# EAGLE design rtmi (EAGLE 9.3.2)
COMPANY: IPL; CREVISION: V1.0; DESIGNER: Rafael Silva; LICENSE: GNU General Public License v3.0; LINK: https://github.com/gimbas/fmc
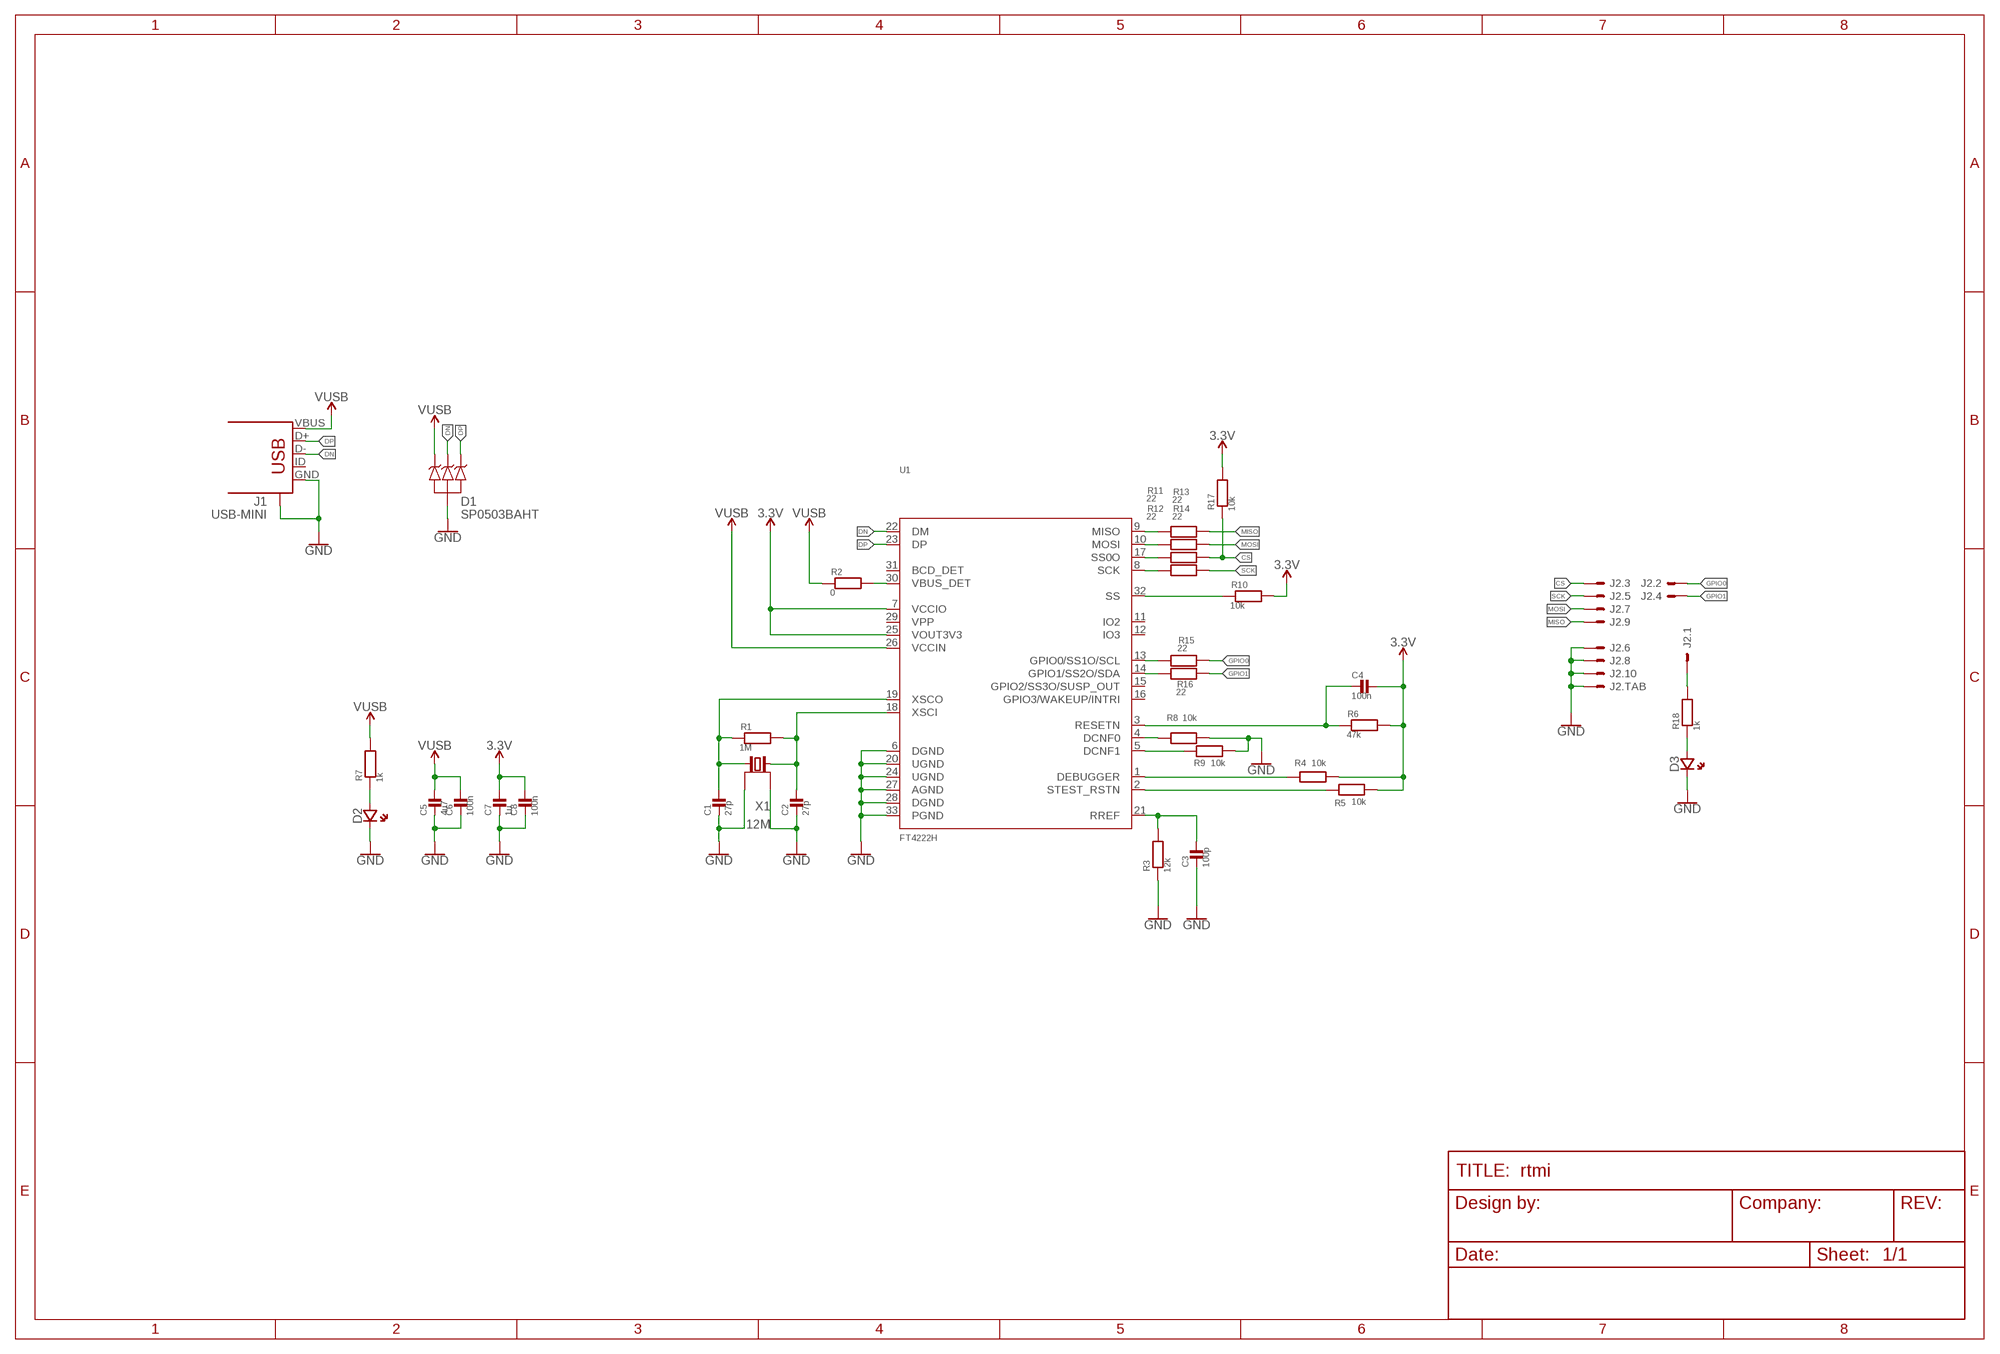
[diagram p0: schematic, sheet 1]

## Parts
C1  27p  MLCC0603  [0603_WAVE]
C2  27p  MLCC0603  [0603_WAVE]
C3  100p  MLCC0603  [0603_WAVE]
C4  100n  MLCC0603  [0603_WAVE]
C5  4u7  MLCC0603  [0603_WAVE]
C6  100n  MLCC0603  [0603_WAVE]
C7  1u  MLCC0603  [0603_WAVE]
C8  100n  MLCC0603  [0603_WAVE]
D1  SP0503BAHT  [SOT143]
D2  LED0603  [CHIPLED_0603]
D3  LED0603  [CHIPLED_0603]
J1  USB-MINI  [USB-MINI-SMD]
J2  F20F-10DP-1V  [F20F-10DP-1V]
R1  1M  RESISTOR0603  [0603_WAVE]
R2  0  RESISTOR0603  [0603_WAVE]
R3  12k  RESISTOR0603  [0603_WAVE]
R4  10k  RESISTOR0603  [0603_WAVE]
R5  10k  RESISTOR0603  [0603_WAVE]
R6  47k  RESISTOR0603  [0603_WAVE]
R7  1k  RESISTOR0603  [0603_WAVE]
R8  10k  RESISTOR0603  [0603_WAVE]
R9  10k  RESISTOR0603  [0603_WAVE]
R10  10k  RESISTOR0603  [0603_WAVE]
R11  22  RESISTOR0603  [0603_WAVE]
R12  22  RESISTOR0603  [0603_WAVE]
R13  22  RESISTOR0603  [0603_WAVE]
R14  22  RESISTOR0603  [0603_WAVE]
R15  22  RESISTOR0603  [0603_WAVE]
R16  22  RESISTOR0603  [0603_WAVE]
R17  10k  RESISTOR0603  [0603_WAVE]
R18  1k  RESISTOR0603  [0603_WAVE]
U1  FT4222H  [QFN32]
X1  12M  CRYSTAL_4P  [4-SMD-3225]

## Nets
3.3V: C4.P$1 C7.P$1 C8.P$1 R4.P$2 R5.P$2 R6.P$2 R10.P$2 R17.P$2 U1.7(VCCIO) U1.25(VOUT3V3)
3V3EXT: J2.1 R18.P$2
3V3EXT_LED: D3.A(AN) R18.P$1
CS: J2.3 R13.P$2 R17.P$1
DCFN1: R9.P$1 U1.5(DCNF1)
DCNF0: R8.P$1 U1.4(DCNF0)
DEBUGGER: R4.P$1 U1.1(DEBUGGER)
DN: D1.3 J1.D- U1.22(DM)
DP: D1.4 J1.D+ U1.23(DP)
GND: C1.P$2 C2.P$2 C3.P$2 C5.P$2 C6.P$2 C7.P$2 C8.P$2 D1.1 D2.C(CA) D3.C(CA) J1.GND J1.GND@1(CASE) J1.GND@2(CASE) J1.GND@3(CASE) J1.GND@4(CASE) J2.6 J2.8 J2.10 J2.TAB1 J2.TAB2 R3.P$1 R8.P$2 R9.P$2 U1.6(DGND) U1.20(UGND) U1.24(UGND) U1.27(AGND) U1.28(DGND) U1.33(PGND) X1.2(GND) X1.4(GND)
GPIO0: J2.2 R15.P$2
GPIO0_PIN: R15.P$1 U1.13(GPIO0/SS1O/SCL)
GPIO1: J2.4 R16.P$2
GPIO1_PIN: R16.P$1 U1.14(GPIO1/SS2O/SDA)
MISO: J2.9 R11.P$2
MISO_PIN: R11.P$1 U1.9(MISO)
MOSI: J2.7 R12.P$2
MOSI_PIN: R12.P$1 U1.10(MOSI)
RESETN: C4.P$2 R6.P$1 U1.3(RESETN)
RREF: C3.P$1 R3.P$2 U1.21(RREF)
SCK: J2.5 R14.P$2
SCK_PIN: R14.P$1 U1.8(SCK)
SS0O_PIN: R13.P$1 U1.17(SS0O)
SS_PIN: R10.P$1 U1.32(SS)
STEST_RSTN: R5.P$1 U1.2(STEST_RSTN)
VBUS_DET: R2.P$2 U1.30(VBUS_DET)
VUSB: C5.P$1 C6.P$1 D1.2 J1.VBUS R2.P$1 R7.P$2 U1.26(VCCIN)
VUSB_LED: D2.A(AN) R7.P$1
XSCI: C2.P$1 R1.P$2 U1.18(XSCI) X1.1
XSCO: C1.P$1 R1.P$1 U1.19(XSCO) X1.3
Unconnected: J1.ID U1.11(IO2) U1.12(IO3) U1.15(GPIO2/SS3O/SUSP_OUT) U1.16(GPIO3/WAKEUP/INTRI) U1.29(VPP) U1.31(BCD_DET)

## Library data of the parts
C1-C8 = Passive Components > Capacitors > Multilayer Ceramic Capacitors MLCC:MLCC: KEMET’s X7R dielectric features a 125°C maximum operating temperature and is considered temperature stable. The Electronics Components, Assemblies and Materials Association (EIA) characterizes X7R dielectric as a Class II material. Components of this classification are fixed, ceramic dielectric capacitors suited for bypass and decoupling applications or for frequency discriminating circuits where Q and stability of capacitance characteristics are not critical. X7R exhibits a predictable change in capacitance with respect to time and voltage, boasting a minimal change in capacitance with reference to ambient temperature. Capacitance change is limited to ±15% from −55°C to +125°C.
D1 = Circuit Protection > ESD Suppressors \ TVS Diodes:SP0503BAHT
D2 D3 = Opto-electronics > LED Emitters:LED: LED 0603 - 0603 Surface Mount Package 2mA: Green LED - Low Power (3.9mcd, 2ma, 1.7Vf) - Digikey: 475-2709-2-ND Orange LED - Low Power (9.8mcd, 2ma, 1.8Vf) - Digikey: 475-1194-2-ND Red LED - Low Power (5mcd, 2ma, 1.8Vf) - Digikey: 475-1195-2-ND Yellow LED - Low Power (7mcd, 2ma, 1.8Vf) - Digikey: 475-1196-2-ND 5mA: Blue LED - Low Power (17mcd, 5ma, 2.9Vf) - Digikey: LNJ937W8CRACT-ND 0805 - 0805 Surface Mount Package 2mA: Red LED (8.8mcd, 2mA, 1.8Vf, Clear) - Low Power [Digikey: 475-2510-1-ND] Green LED (5mcd, 2mA, 1.8Vf, Clear) - Low Power [Digikey: 475-2730-1-ND] Yellow LED (11.3mcd, 2mA, 1.8Vf, Clear) - Low Power [Digikey: 475-2555-1-ND] 20mA: Red LED (104mcd, 20mA, Diffused) - LS R976 [Digikey: 475-1278-6-ND] Red LED (12mcd, 20mA, 2.0Vf, Clear) - APT2012EC [Digikey: 754-1128-1-ND] Green LED (15mcd, 20mA, 2.2Vf, Clear) - APT2012GC [Digikey: 754-1131-1-ND] Orange LED (160mcd, 20mA, 2.1Vf, Clear) - APT2012SECK [Digikey: 754-1130-1-ND] 1206 - 1206 Surface Mount Package Green LED (26mcd, 20mA, Diffused) - LG N971 [Digikey: 475-1407-6-ND] Red LED (15mcd, 20mA, Diffused) - LH N974 [Digikey: 475-1416-6-ND] Cree - Cree High-Power Surface Mount LEDs XPEBWT-L1-0000-00D50 - White 111lm 350mA 2.9Vf 6200K 110° XTEAWT-00-0000-00000LEE3 - White 114lm 350mA 2.85Vf 5000K 115° Everlight - Everlight 45-21 Series Surface Mount LEDs 45-21/QK2C-B2832AC2CB2/2T - Warm White 2000mcd 20mA 3.25Vf 3050K 120° 45-21/LK2C-B38452C4CB2/2T - Nuetral White 2000mcd 20mA 3.25Vf 4150K 120° 45-21/LK2C-B50634C6CB2/2T - Cold White 2200mcd 20mA 3.25Vf 5650K 120° PLCC2 Reverse Mount LS T77K-J1L2-1-0-2-R18-Z - Red 11.25mcd 2mA 1.8Vf 630nm 120° LO T77K-L1M2-24-Z - Orange 19.6mcd 2mA 1.8Vf 606nm 120° LY T77K-K2M1-26-Z - Yellow 15.7mcd 2mA 1.8Vf 587nm 120°
J1 = Connectors > USB:USB-MINI
J2 = Connectors > Other:F20F-10DP-1V
R1-R18 = Passive Components > Resistors > Chip Resistors:RESISTOR: Resistors For new designs, use the packages preceded by an '_' character since they are more reliable: The following footprints should be used on most boards: _0402 - Standard footprint for regular board layouts _0603 - Standard footprint for regular board layouts _0805 - Standard footprint for regular board layouts _1206 - Standard footprint for regular board layouts For extremely tight-pitch boards where space is at a premium, the following 'micro-pitch' footprints can be used (smaller pads, no silkscreen outline, etc.): _0402MP - Micro-pitch footprint for very dense/compact boards _0603MP - Micro-pitch footprint for very dense/compact boards _0805MP - Micro-pitch footprint for very dense/compact boards _1206MP - Micro-pitch footprint for very dense/compact boards
U1 = Semiconductors > Integrated Circuits - ICs > Interface ICs > USB Interface IC:FT4222H
X1 = Passive Components > Frequency Control & Timing Devices > Crystals:CRYSTAL_4P

## Board
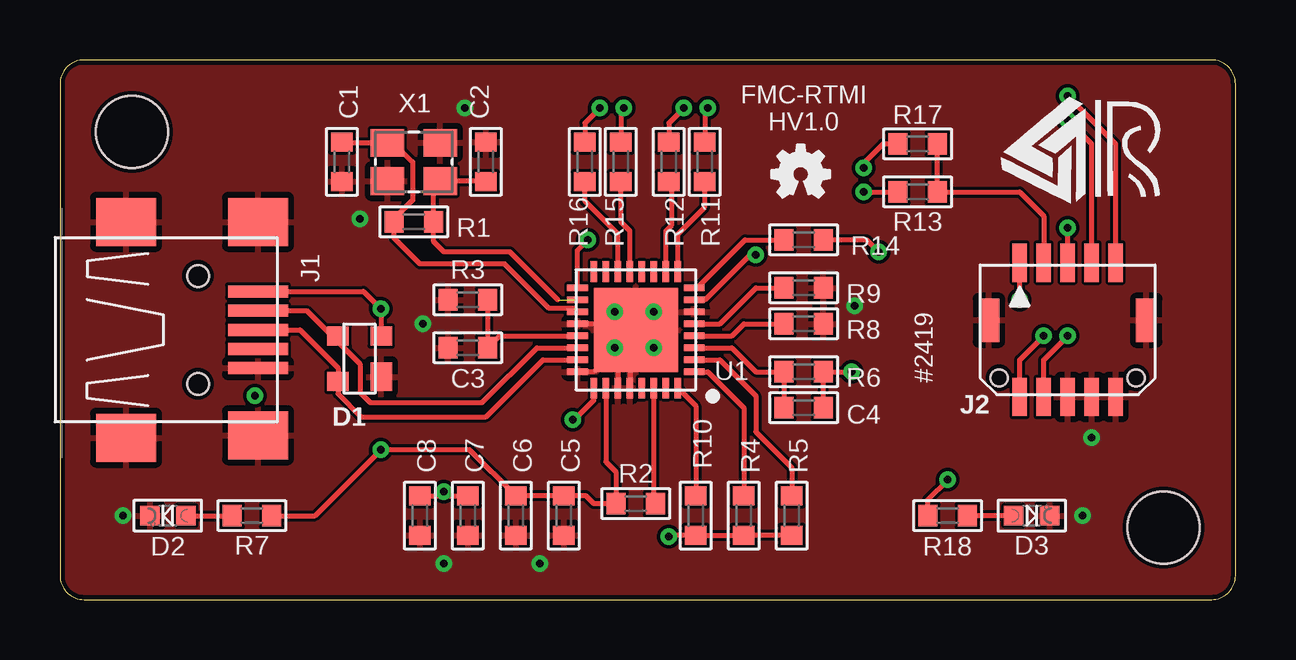
[diagram p1: board, top side]
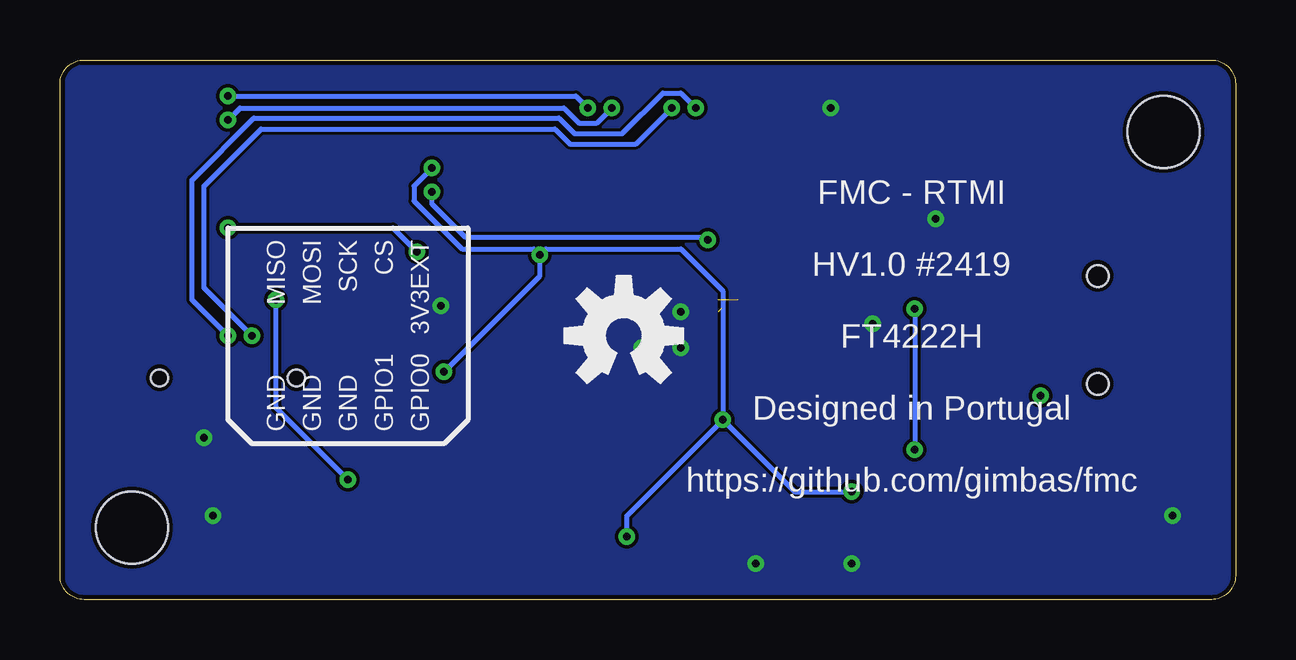
[diagram p2: board, bottom side, seen from below]

Size 49 x 22.5 mm. Coordinates in mm from the lower left corner, seen from the top.
Outline: 1,0 48,0 arc90 49,1 49,21.5 arc90 48,22.5 1,22.5 arc90 0,21.5 0,1 arc90 1,0
Copper layers (1*16): Top 0.035mm / dielectric 1.6mm / Bottom 0.035mm
Design rules "jlcpcb-dr": minimum track width 5mil, minimum drill 0.3mm, track to track 5mil, track to pad 5mil, pad to pad 5mil, via to via 5mil, smd to smd 5mil, copper to edge 0.2mm, drill to drill 5mil, minimum pad ring 10mil, minimum via ring 8mil, stop-mask expansion 4mil, vias tented up to drill 0.7mm, thermal gap 10mil
Holes 3 mm at 3,19.5 46,3

### Footprints (pad centres in the part's own frame; a part is rotated, then mirrored left to right if it is on the bottom)
0603_WAVE = smd 0.8 x 0.9: P$1 -0.823,0; P$2 0.823,0
SOT143 = smd 1.2 x 0.9: 1 -0.711,-0.889 | smd 0.8 x 0.9: 2 0.989,-0.889; 3 0.989,0.911; 4 -0.911,0.911
CHIPLED_0603 = smd 0.8 x 0.8: A 0,-0.75; C 0,0.75
USB-MINI-SMD = smd 2.5 x 0.5: D+ 2.75,0; D- 2.75,0.8; GND 2.75,-1.6; ID 2.75,-0.8; VBUS 2.75,1.6 | smd 2.5 x 2: GND@1 -2.75,-4.5; GND@2 -2.75,4.5; GND@3 2.75,-4.4; GND@4 2.75,4.5 | hole 0.9: 0.25,2.25; 0.25,-2.25
F20F-10DP-1V = smd 0.6 x 1.6: 1 -2,2.8; 2 -2,-2.8; 3 -1,2.8; 4 -1,-2.8; 5 0,2.8; 6 0,-2.8; 7 1,2.8; 8 1,-2.8; 9 2,2.8; 10 2,-2.8 | smd 0.85 x 1.8: TAB1 -3.275,0.4; TAB2 3.275,0.4 | hole 0.7: -2.85,-2.005; 2.85,-2.005
QFN32 = smd 0.86 x 0.26: 1 -2.43,1.75; 2 -2.43,1.25; 3 -2.43,0.75; 4 -2.43,0.25; 5 -2.43,-0.25; 6 -2.43,-0.75; 7 -2.43,-1.25; 8 -2.43,-1.75; 17 2.43,-1.75; 18 2.43,-1.25; 19 2.43,-0.75; 20 2.43,-0.25; 21 2.43,0.25; 22 2.43,0.75; 23 2.43,1.25; 24 2.43,1.75 | smd 0.26 x 0.86: 9 -1.75,-2.43; 10 -1.25,-2.43; 11 -0.75,-2.43; 12 -0.25,-2.43; 13 0.25,-2.43; 14 0.75,-2.43; 15 1.25,-2.43; 16 1.75,-2.43; 25 1.75,2.43; 26 1.25,2.43; 27 0.75,2.43; 28 0.25,2.43; 29 -0.25,2.43; 30 -0.75,2.43; 31 -1.25,2.43; 32 -1.75,2.43 | smd 3.5 x 3.5: 33 0,0
4-SMD-3225 = smd 1.4 x 1.15: 1 -1.1,0.8; 2 1.1,0.8; 3 1.1,-0.8; 4 -1.1,-0.8

### Placement (x,y rotation side)
C1  11.75,18.25 270 top
C2  17.75,18.25 90 top
C3  17,12.5 180 top
C4  31,8 180 top
C5  21,3.5 270 top
C6  19,3.5 270 top
C7  17,3.5 270 top
C8  15,3.5 270 top
D1  12.5,10 90 top
D2  4.5,3.5 90 top
D3  40.5,3.5 270 top
J1  5.5,11.25 0 top
J2  42,11.25 0 top
R1  14.75,15.75 0 top
R2  24,4 0 top
R3  17,10.5 0 top
R4  28.5,3.5 270 top
R5  30.5,3.5 270 top
R6  31,9.5 0 top
R7  8,3.5 0 top
R8  31,11.5 0 top
R9  31,13 0 top
R10  26.5,3.5 270 top
R11  26.88,18.25 90 top
R12  25.38,18.25 90 top
R13  35.75,17 0 top
R14  31,15 0 top
R15  23.38,18.25 90 top
R16  21.88,18.25 90 top
R17  35.75,19 180 top
R18  37,3.5 180 top
U1  24,11.25 180 top
U$1  [OSHW-LOGO-M]  25.5,11 0 bottom
U$2  [OSHW-LOGO-MINI]  30.88,17.75 0 top
U$4  [RAFAEL_SILVA_5MM_ALT_3]  40,18.5 0 top
X1  14.75,18.25 180 top

### Tracks (layer width: path | path; a pad name or v marks a point on that pad's centre or on a via)
3.3V  (via drill 0.3)
  Top 0.2: v29,14.38 28.75,14.38 26.88,12.5 U1.7 | v21.38,7.5 21.43,7.5 22.25,8.32 U1.25 | C7.P$1 16.18,4.32 v16,4.5 15.82,4.32 C8.P$1 | R5.P$2 R4.P$2 R10.P$2 25.43,2.68 v25.38,2.62 | v33.5,18 33.5,18.2 34.3,19 R17.P$2 | C4.P$1 R6.P$2 v33,9.5
  Bottom 0.2: v29,14.38 28.75,14.62 23.12,14.62 21.38,12.88 v21.38,7.5 | v21.38,7.5 18.38,4.5 v16,4.5 | v25.38,2.62 25.38,3.5 v21.38,7.5 | v33.5,18 34.25,17.25 34.25,16.62 32.25,14.62 29.25,14.62 v29,14.38 | v33,9.5 29,13.5 v29,14.38
3V3EXT  (via drill 0.3)
  Top 0.2: R18.P$2 36.18,4.18 v37,5 | v40,12.5 J2.1
  Bottom 0.2: v37,5 40,8 v40,12.5
3V3EXT_LED
  Top 0.2: D3.A R18.P$1
CS
  Top 0.2: R17.P$1 R13.P$2 40,17 41,16 J2.3
DCFN1
  Top 0.2: U1.5 27.5,11.5 29,13 R9.P$1
DCNF0
  Top 0.2: U1.4 28,11 28.5,11.5 R8.P$1
DEBUGGER
  Top 0.2: U1.1 27,9.5 28.5,8 R4.P$1
DN
  Top 0.2: J1.D- 10.28,12.05 11.34,10.99 D1.3 11.59,10.74 12.5,9.83 12.5,8.64 12.93,8.21 17.59,8.21 19.88,10.5 U1.22
DP
  Top 0.2: J1.D+ 10,11.25 11.59,9.66 D1.4 11.59,8.59 12.55,7.62 17.75,7.62 20.12,10 U1.23
GND  (via drill 0.3)
  Top 0.2: U1.33 23.75,11.5 U1.20 | 23.25,10.5 22.25,9.5 U1.24 | 23.75,11 23.25,10.5 | 23.25,10.5 U1.27 | 23.75,11 U1.28 | U1.33 23.25,12 v23.12,12 | U1.33 23.75,11 | U1.33 v24.75,12
  other vias: 23.12,10.5 24.75,10.5 2.62,3.5 16,1.5 20,1.5 42.62,3.5 43,6.75 33.12,12.25 15.12,11.5 16.88,20.5 12.5,15.88
  pour Top: 0,22.5 49,22.5 49,0 0,0
  pour Bottom: 0,22.5 49,22.5 49,0 0,0
GND1  (via drill 0.3)
  other vias: 8.12,8.5
GPIO0  (via drill 0.3)
  Top 0.2: J2.2 40,10 v41,11 | v23.5,20.5 23.38,20.38 R15.P$2
  Bottom 0.2: v41,11 43,13 43,17.25 40.62,19.62 28.38,19.62 27.75,19 25,19 v23.5,20.5
GPIO0_PIN
  Top 0.2: U1.13 23.75,15.38 23.38,15.75 R15.P$1
GPIO1  (via drill 0.3)
  Top 0.2: J2.4 41,10 v42,11 | v22.5,20.5 21.88,19.88 R16.P$2
  Bottom 0.2: v42,11 43.5,12.5 43.5,17.5 40.92,20.08 28.2,20.08 27.55,19.42 25.58,19.42 23.88,21.12 23.12,21.12 v22.5,20.5
GPIO1_PIN
  Top 0.2: U1.14 23.25,15.25 21.88,16.62 R16.P$1
MISO  (via drill 0.3)
  Top 0.2: J2.9 44,19 v42,21 | v27,20.5 26.88,20.38 R11.P$2
  Bottom 0.2: v42,21 27.5,21 v27,20.5
MISO_PIN
  Top 0.2: U1.9 25.75,15.25 26.88,16.38 R11.P$1
MOSI  (via drill 0.3)
  Top 0.2: J2.7 43,19 v42,20 | v26,20.5 25.38,19.88 R12.P$2
  Bottom 0.2: v42,20 41.5,20.5 28,20.5 27.38,19.88 26.62,19.88 v26,20.5
MOSI_PIN
  Top 0.2: U1.10 25.25,15.38 25.5,15.62 25.5,17.3 R12.P$1
RESETN
  Top 0.2: U1.3 28,10.5 29,9.5 R6.P$1 C4.P$2
RREF
  Top 0.2: U1.21 18.32,11 R3.P$2 C3.P$1
SCK  (via drill 0.3)
  Top 0.2: J2.5 v42,15.5 | v34.12,14.5 33.62,15 R14.P$2
  Bottom 0.2: v42,15.5 35.12,15.5 v34.12,14.5
SCK_PIN
  Top 0.2: R14.P$1 28.55,15 26.55,13 U1.8
SS0O_PIN  (via drill 0.3)
  Top 0.2: U1.17 21.57,14.57 v22,15 | v33.5,17 R13.P$1
  Bottom 0.2: v22,15 22.12,15.12 32.12,15.12 33.5,16.5 v33.5,17
SS_PIN
  Top 0.2: U1.32 26.5,8.07 R10.P$1
STEST_RSTN
  Top 0.2: U1.2 27.5,10 29,8.5 29,7 30.5,5.5 R5.P$1
VBUS_DET
  Top 0.2: R2.P$2 24.75,4.07 U1.30
VUSB  (via drill 0.3)
  Top 0.2: U1.26 22.75,5.75 23.18,5.32 R2.P$1 22.25,4 21.93,4.32 C5.P$1 C6.P$1 17.07,6.25 v13.38,6.25 10.62,3.5 R7.P$2 | D1.2 v13.39,12.11 v13.38,12.12 12.65,12.85 J1.VBUS
  Bottom 0.2: v13.38,12.12 v13.38,6.25
VUSB_LED
  Top 0.2: D2.A R7.P$1
XSCI  (1 unrouted)
  Top 0.2: 20.75,12.5 18.75,14.5 16,14.5 15.57,14.93 R1.P$2 15.57,17.17 X1.1 17.73,17.45 C2.P$1
XSCO  (1 unrouted)
  Top 0.2: 21.43,12.14 20.39,12.14 18.54,14 15,14 13.93,15.07 R1.P$1 13.93,15.88 14.7,16.66 14.7,18.25 13.9,19.05 X1.3 11.77,19.05 C1.P$1

### Text on the board
tPlace: FMC-RTMI / HV1.0 | #2419
bPlace: 3V3EXT | CS | SCK | MOSI | MISO | FMC - RTMI / / HV1.0 #2419 / / FT4222H / / Designed in Portugal / / https://github.com/gimbas/fmc | GPIO0 | GPIO1 | GND | GND | GND